# Altium project 转接板.PrjPcb
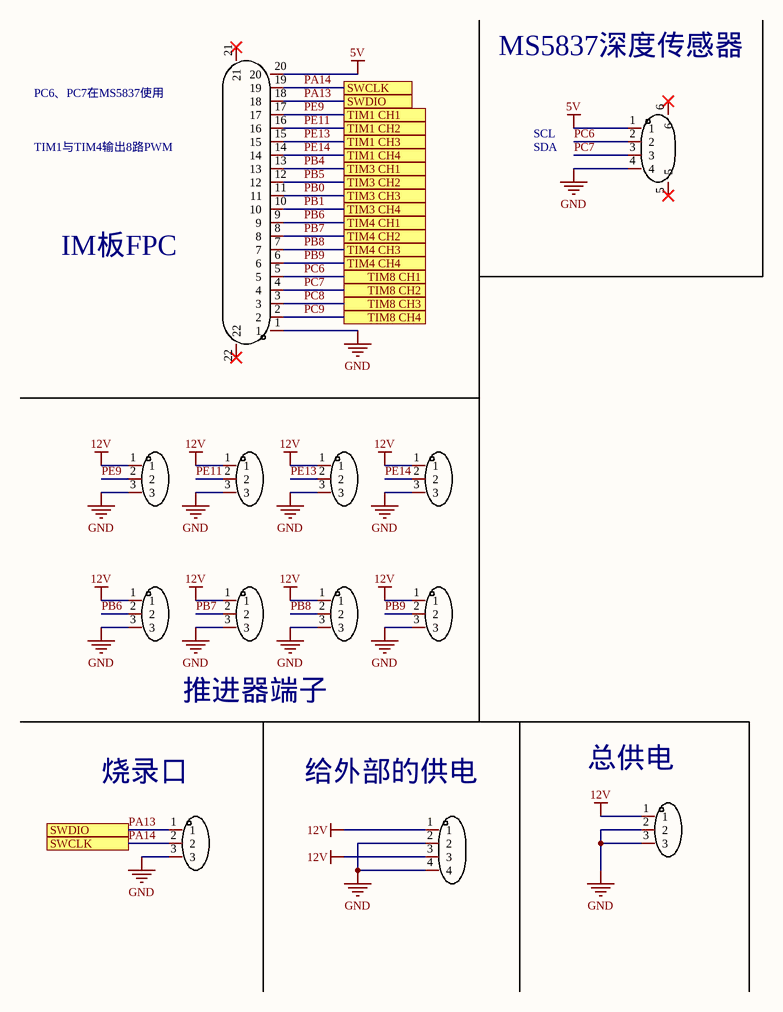
[diagram p0: Sheet1.SchDoc]
1 sheet, 13 parts. Net scope: flat (ports and power ports of the same name join across sheets).
Board file: PCB1.PcbDoc

## Sheet Sheet1.SchDoc
size A4; SheetNumber: 1; SheetTotal: 1

### Parts
CN1  KF2EDGV-3.81-4P_C441334  [CONN-TH_4P-P3.81_KF2EDGV-3.81-4P]  (value not drawn)
FPC  FPC-05F-20PH20  [FPC-SMD_20P-P0.50_XUNPU_FPC-05F-20PH20]  (value not drawn)
MS5837  HC-1.25-4PWT  [CONN-SMD_4P-P1.25-HC-1.25-4PWT]  (value not drawn)
PB6  MR30-M  [CONN-TH_MR30-M]  (value not drawn)
PB7  MR30-M  [CONN-TH_MR30-M]  (value not drawn)
PB8  MR30-M  [CONN-TH_MR30-M]  (value not drawn)
PB9  MR30-M  [CONN-TH_MR30-M]  (value not drawn)
PE9  MR30-M  [CONN-TH_MR30-M]  (value not drawn)
PE11  MR30-M  [CONN-TH_MR30-M]  (value not drawn)
PE13  MR30-M  [CONN-TH_MR30-M]  (value not drawn)
PE14  MR30-M  [CONN-TH_MR30-M]  (value not drawn)
POWER  MR30-M  [CONN-TH_MR30-M]  (value not drawn)
SW  KF2EDGV-3.81-3P  [CONN-TH_3P-P3.81_KF2EDGV-3.81-3P]  (value not drawn)

### Ports
SWCLK, SWDIO, TIM1 CH1, TIM1 CH2, TIM1 CH3, TIM1 CH4, TIM3 CH1, TIM3 CH2, TIM3 CH3, TIM3 CH4, TIM4 CH1, TIM4 CH2, TIM4 CH3, TIM4 CH4, TIM8 CH1, TIM8 CH2, TIM8 CH3, TIM8 CH4

### Nets
5V: FPC.20 MS5837.1
12V: CN1.1 CN1.3 PB6.1 PB7.1 PB8.1 PB9.1 PE9.1 PE11.1 PE13.1 PE14.1 POWER.1
GND: CN1.2 CN1.4 FPC.1 MS5837.4 PB6.3 PB7.3 PB8.3 PB9.3 PE9.3 PE11.3 PE13.3 PE14.3 POWER.2 POWER.3 SW.3
PA13: FPC.18 SW.1 ; port SWDIO
PA14: FPC.19 SW.2 ; port SWCLK
PB0: FPC.11 ; port TIM3 CH3
PB1: FPC.10 ; port TIM3 CH4
PB4: FPC.13 ; port TIM3 CH1
PB5: FPC.12 ; port TIM3 CH2
PB6: FPC.9 PB6.2 ; port TIM4 CH1
PB7: FPC.8 PB7.2 ; port TIM4 CH2
PB8: FPC.7 PB8.2 ; port TIM4 CH3
PB9: FPC.6 PB9.2 ; port TIM4 CH4
PC6: FPC.5 MS5837.2 ; port TIM8 CH1
PC7: FPC.4 MS5837.3 ; port TIM8 CH2
PC8: FPC.3 ; port TIM8 CH3
PC9: FPC.2 ; port TIM8 CH4
PE9: FPC.17 PE9.2 ; port TIM1 CH1
PE11: FPC.16 PE11.2 ; port TIM1 CH2
PE13: FPC.15 PE13.2 ; port TIM1 CH3
PE14: FPC.14 PE14.2 ; port TIM1 CH4

Not connected (* = marked no-connect by the designer): FPC 21* 22*; MS5837 5* 6*

### Notes on the sheet
- PC6、PC7在MS5837使用
- (near MS5837) MS5837深度传感器
- TIM1与TIM4输出8路PWM
- SDA
- SCL
- IM板FPC
- 推进器端子
- (near POWER) 总供电
- 烧录口
- 给外部的供电

### Library data of the parts
CN1 = KF2EDGV-3.81-4P_C441334: Manufacturer: KEFA(科发); Add into BOM: yes; Connector Type: 板端/插座-闭口; Pitch: 3.81mm; Number of PINs Per Row: 4; Current Rating (Max): 8A; Voltage Rating (Max): 300V; Name: KF2EDGV-3.81-4P; Symbol: KF2EDGV-3.81-4P; Device: KF2EDGV-3.81-4P_C441334; LCSC Part Name: 板端/插座-闭口 3.81mm 排数:1 每排P数:4 直针; Supplier Part: C441334; Manufacturer Part: KF2EDGV-3.81-4P; Supplier Footprint: 直插,P=3.81mm; JLCPCB Part Class: Extended Part; Datasheet: https://atta.szlcsc.com/upload/public/pdf/source/20191023/C441334_2B3686AE66497D0AF2D450E865A6AACE.pdf; Supplier: LCSC; Convert to PCB: yes; Number of Rows: 1; Mounting Style: 直针; Wire Gauge - AWG: -; Wire Gauge - mm?: -; Operating Temperature Range: -40℃~+105℃; Color: 绿色
FPC = FPC-05F-20PH20: Manufacturer: XUNPU(讯普); Add into BOM: yes; Name: FPC-05F-20PH20; Symbol: FPC-05F-20PH20; Device: FPC-05F-20PH20; LCSC Part Name: 20P 0.5mm; Supplier Part: C2856803; Manufacturer Part: FPC-05F-20PH20; Supplier Footprint: SMD; JLCPCB Part Class: Extended Part; Supplier: LCSC; Convert to PCB: yes
MS5837 = HC-1.25-4PWT: Manufacturer: HCTL(华灿天禄); Add into BOM: yes; Pitch: 1.25mm; Pins Structure: 1x4P; Number of PINs Per Row: 4; Gender: 公型插针; Current Rating (Max): 1A; Name: HC-1.25-4PWT; Symbol: HC-1.25-4PWT; Device: HC-1.25-4PWT; LCSC Part Name: 1.25mm 1x4P 卧贴; Supplier Part: C2845381; Manufacturer Part: HC-1.25-4PWT; Supplier Footprint: SMD,P=1.25mm; JLCPCB Part Class: Extended Part; Datasheet: https://atta.szlcsc.com/upload/public/pdf/source/20210728/C2845379_48B7DC28A4B35DB030A7253F7C3FD974.pdf; Supplier: LCSC; Convert to PCB: yes; Reference Series: -; Number of Rows: 1; Row Spacing: -; Mounting Style: 卧贴; Operating Temperature Range: -25℃~+85℃
PB6-PB9 PE9 PE11 PE13 PE14 POWER = MR30-M: Manufacturer: AMASS(艾迈斯); Add into BOM: yes; Name: MR30-M; Symbol: MR30-M; Device: MR30-M; LCSC Part Name: AMASS(艾迈斯)锂电池三芯电源连接器公头MR30-M 2件套; Supplier Part: C99873; Manufacturer Part: MR30-M; Supplier Footprint: -; JLCPCB Part Class: Extended Part; Datasheet: https://atta.szlcsc.com/upload/public/pdf/source/20170412/1491969315720.pdf; Supplier: LCSC; Convert to PCB: yes
SW = KF2EDGV-3.81-3P: Manufacturer: KEFA(科发); Add into BOM: yes; Connector Type: 板端/插座-闭口; Pitch: 3.81mm; Number of PINs Per Row: 3; Current Rating (Max): 8A; Voltage Rating (Max): 300V; Name: KF2EDGV-3.81-3P; Symbol: KF2EDGV-3.81-3P; Device: KF2EDGV-3.81-3P; LCSC Part Name: 板端/插座-闭口 3.81mm 排数:1 每排P数:3 直针; Supplier Part: C441333; Manufacturer Part: KF2EDGV-3.81-3P; Supplier Footprint: 直插,P=3.81mm; JLCPCB Part Class: Extended Part; Datasheet: https://atta.szlcsc.com/upload/public/pdf/source/20191023/C441333_64A45A3FA7EEF66FCEFDF359E788B867.pdf; Supplier: LCSC; Convert to PCB: yes; Number of Rows: 1; Mounting Style: 直针; Wire Gauge - AWG: -; Wire Gauge - mm?: -; Operating Temperature Range: -40℃~+105℃; Color: 绿色